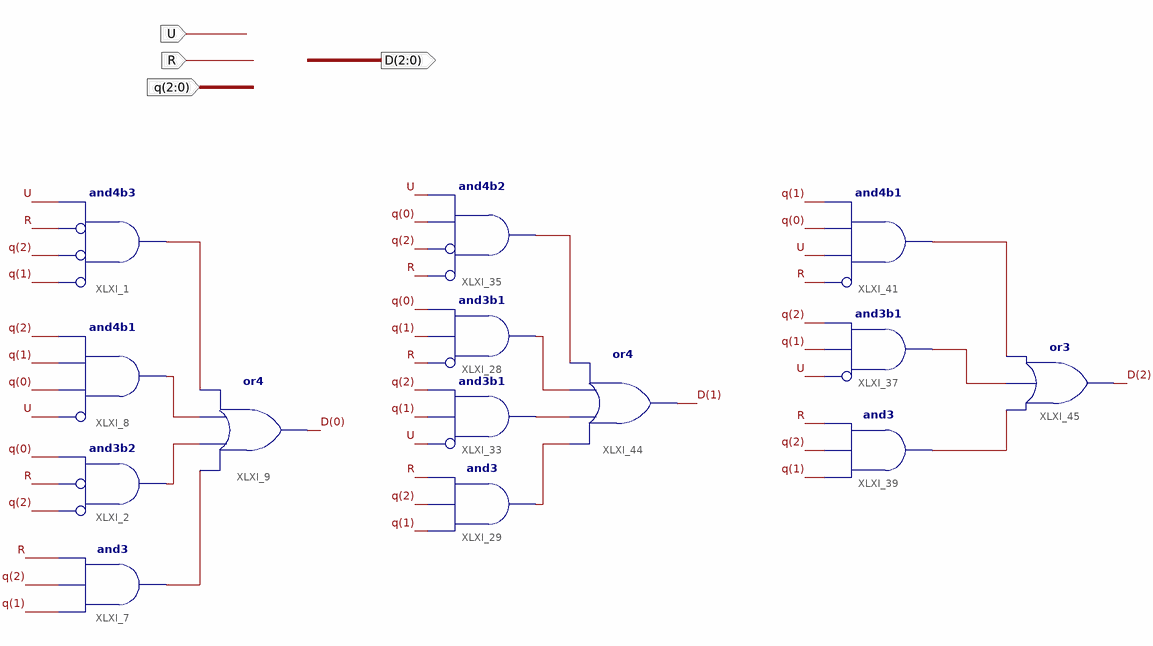
[diagram p0: schematic sheet 1]
// Xilinx ISE schematic Control_Combinacional.sch (spartan6) as structural Verilog: 14 symbols, 4 ports
module Control_Combinacional (
  input  U,
  input  R,
  input  [2:0] q,
  output [2:0] D
);

  wire XLXN_49, XLXN_50, XLXN_51, XLXN_121, XLXN_139, XLXN_140, XLXN_141, XLXN_142, XLXN_154, XLXN_155,
       XLXN_161;

  and XLXI_1 (XLXN_49, ~q[1], ~q[2], ~R, U);  // and4b3
  and XLXI_2 (XLXN_51, ~q[2], ~R, q[0]);  // and3b2
  and XLXI_8 (XLXN_121, ~U, q[0], q[1], q[2]);  // and4b1
  and XLXI_7 (XLXN_50, q[1], q[2], R);
  or XLXI_9 (D[0], XLXN_50, XLXN_51, XLXN_121, XLXN_49);
  and XLXI_28 (XLXN_140, ~R, q[1], q[0]);  // and3b1
  and XLXI_29 (XLXN_142, q[1], q[2], R);
  and XLXI_33 (XLXN_141, ~U, q[1], q[2]);  // and3b1
  and XLXI_35 (XLXN_139, ~R, ~q[2], q[0], U);  // and4b2
  and XLXI_37 (XLXN_155, ~U, q[1], q[2]);  // and3b1
  and XLXI_41 (XLXN_154, ~R, U, q[0], q[1]);  // and4b1
  or XLXI_44 (D[1], XLXN_142, XLXN_141, XLXN_140, XLXN_139);
  or XLXI_45 (D[2], XLXN_161, XLXN_155, XLXN_154);
  and XLXI_39 (XLXN_161, q[1], q[2], R);
endmodule
